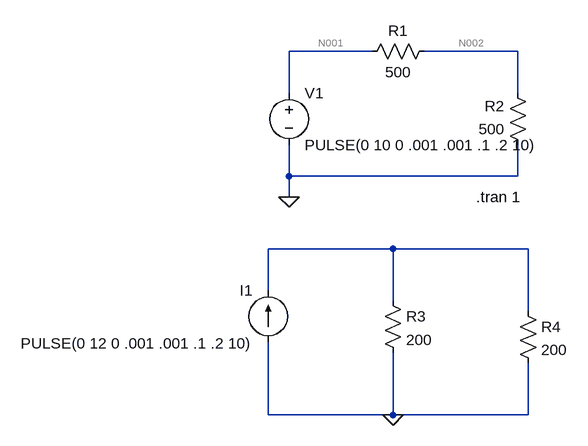
[diagram p0: schematic 0_VoltageAndCurrentDivider.asc]
0_VoltageAndCurrentDivider.asc, the LTspice schematic file:
Version 4
SHEET 1 1220 680
WIRE 160 32 32 32
WIRE 384 32 240 32
WIRE 32 96 32 32
WIRE 384 96 384 32
WIRE 32 224 32 176
WIRE 384 224 384 176
WIRE 384 224 32 224
WIRE 32 256 32 224
WIRE 192 336 0 336
WIRE 400 336 192 336
WIRE 0 400 0 336
WIRE 192 416 192 336
WIRE 400 432 400 336
WIRE 0 592 0 480
WIRE 192 592 192 496
WIRE 192 592 0 592
WIRE 400 592 400 512
WIRE 400 592 192 592
FLAG 32 256 0
FLAG 192 592 0
SYMBOL voltage 32 80 R0
WINDOW 123 0 0 Left 0
WINDOW 39 0 0 Left 0
SYMATTR InstName V1
SYMATTR Value PULSE(0 10 0 .001 .001 .1 .2 10)
SYMBOL res 256 16 R90
WINDOW 0 0 56 VBottom 2
WINDOW 3 32 56 VTop 2
SYMATTR InstName R1
SYMATTR Value 500
SYMBOL res 400 192 R180
WINDOW 0 36 76 Left 2
WINDOW 3 36 40 Left 2
SYMATTR InstName R2
SYMATTR Value 500
SYMBOL current 0 480 R180
WINDOW 0 24 80 Left 2
WINDOW 3 23 -2 Left 2
WINDOW 123 0 0 Left 0
WINDOW 39 0 0 Left 0
SYMATTR InstName I1
SYMATTR Value PULSE(0 12 0 .001 .001 .1 .2 10)
SYMBOL res 176 400 R0
SYMATTR InstName R3
SYMATTR Value 200
SYMBOL res 384 416 R0
SYMATTR InstName R4
SYMATTR Value 200
TEXT 320 256 Left 2 !.tran 1

The netlist it stands for:
* 0_VoltageAndCurrentDivider.asc
V1 N001 0 PULSE(0 10 0 .001 .001 .1 .2 10)
R1 N002 N001 500
R2 0 N002 500
I1 0 N003 PULSE(0 12 0 .001 .001 .1 .2 10)
R3 N003 0 200
R4 N003 0 200
.tran 1
.backanno
.end

* Results of the author's LTspice run, read from the files saved beside the schematic
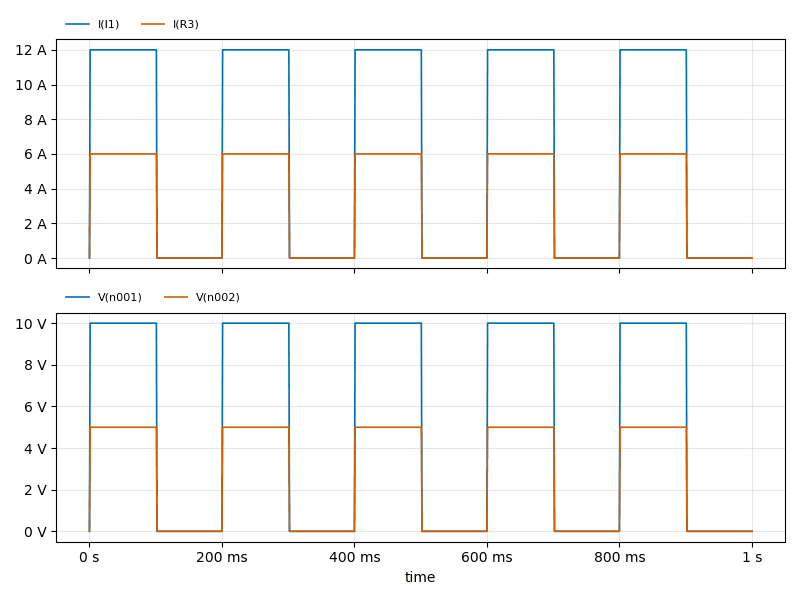
[diagram p1: Transient Analysis of 0_VoltageAndCurrentDivider.asc, plotted from the saved traces]
* Transient Analysis, 1 run:
*   I(I1): min 0 A, max 12 A, average 6.06 A, rms 8.528 A, last 0 A
*   I(R3): min 0 A, max 6 A, average 3.03 A, rms 4.264 A, last 0 A
*   V(n001): min 0 V, max 10 V, average 5.05 V, rms 7.106 V, last 0 V
*   V(n002): min 0 V, max 5 V, average 2.525 V, rms 3.553 V, last 0 V